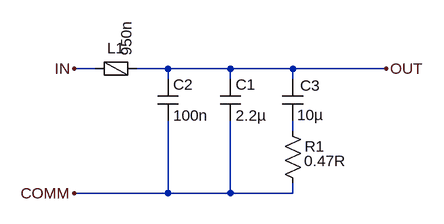
[diagram p0: schematic boost-converter_output-filter.asc]
boost-converter_output-filter.asc, the LTspice schematic file:
Version 4
SHEET 1 880 680
WIRE -32 96 -64 96
WIRE 80 96 32 96
WIRE 176 96 80 96
WIRE 272 96 176 96
WIRE 416 96 272 96
WIRE 80 112 80 96
WIRE 176 112 176 96
WIRE 272 112 272 96
WIRE 272 192 272 176
WIRE 80 288 80 176
WIRE 80 288 -64 288
WIRE 176 288 176 176
WIRE 176 288 80 288
WIRE 272 288 272 272
WIRE 272 288 176 288
FLAG -64 96 IN
FLAG 416 96 OUT
FLAG -64 288 COMM
SYMBOL cap 160 112 R0
SYMATTR InstName C1
SYMATTR Value 2.2µ
SYMATTR SpiceLine V=25 Irms=0 Rser=0.001
SYMATTR SpiceLine2 IC=4.9
SYMBOL FerriteBead 0 96 R270
WINDOW 0 16 0 VTop 2
SYMATTR InstName L1
SYMATTR Value 950n
SYMATTR SpiceLine Ipk=3 Rser=0.029 Rpar=290 Cpar=1.45p
SYMBOL cap 64 112 R0
SYMATTR InstName C2
SYMATTR Value 100n
SYMATTR SpiceLine V=25 Irms=0 Rser=0.001
SYMATTR SpiceLine2 IC=4.9
SYMBOL cap 288 176 R180
WINDOW 0 -26 54 Left 2
WINDOW 3 -31 9 Left 2
SYMATTR InstName C3
SYMATTR Value 10µ
SYMATTR SpiceLine IC=4.9
SYMBOL res 288 288 R180
WINDOW 0 -33 72 Left 2
WINDOW 3 -66 50 Left 2
SYMATTR InstName R1
SYMATTR Value 0.47R

The netlist it stands for:
* boost-converter_output-filter.asc
C1 OUT COMM 2.2µ V=25 Irms=0 Rser=0.001 IC=4.9
L1 IN OUT 950n Ipk=3 Rser=0.029 Rpar=290 Cpar=1.45p
C2 OUT COMM 100n V=25 Irms=0 Rser=0.001 IC=4.9
C3 N001 OUT 10µ IC=4.9
R1 COMM N001 0.47R
.backanno
.end